# EasyEDA schematic SENSOR_SCH_FPC.json
TITLE: DRONE_SENSOR_SHIELD_FPC; REV: 2.0; Date: 17-11-2023; Sheet: 1/1; Drawn By: J.Rainey; Company: QUB
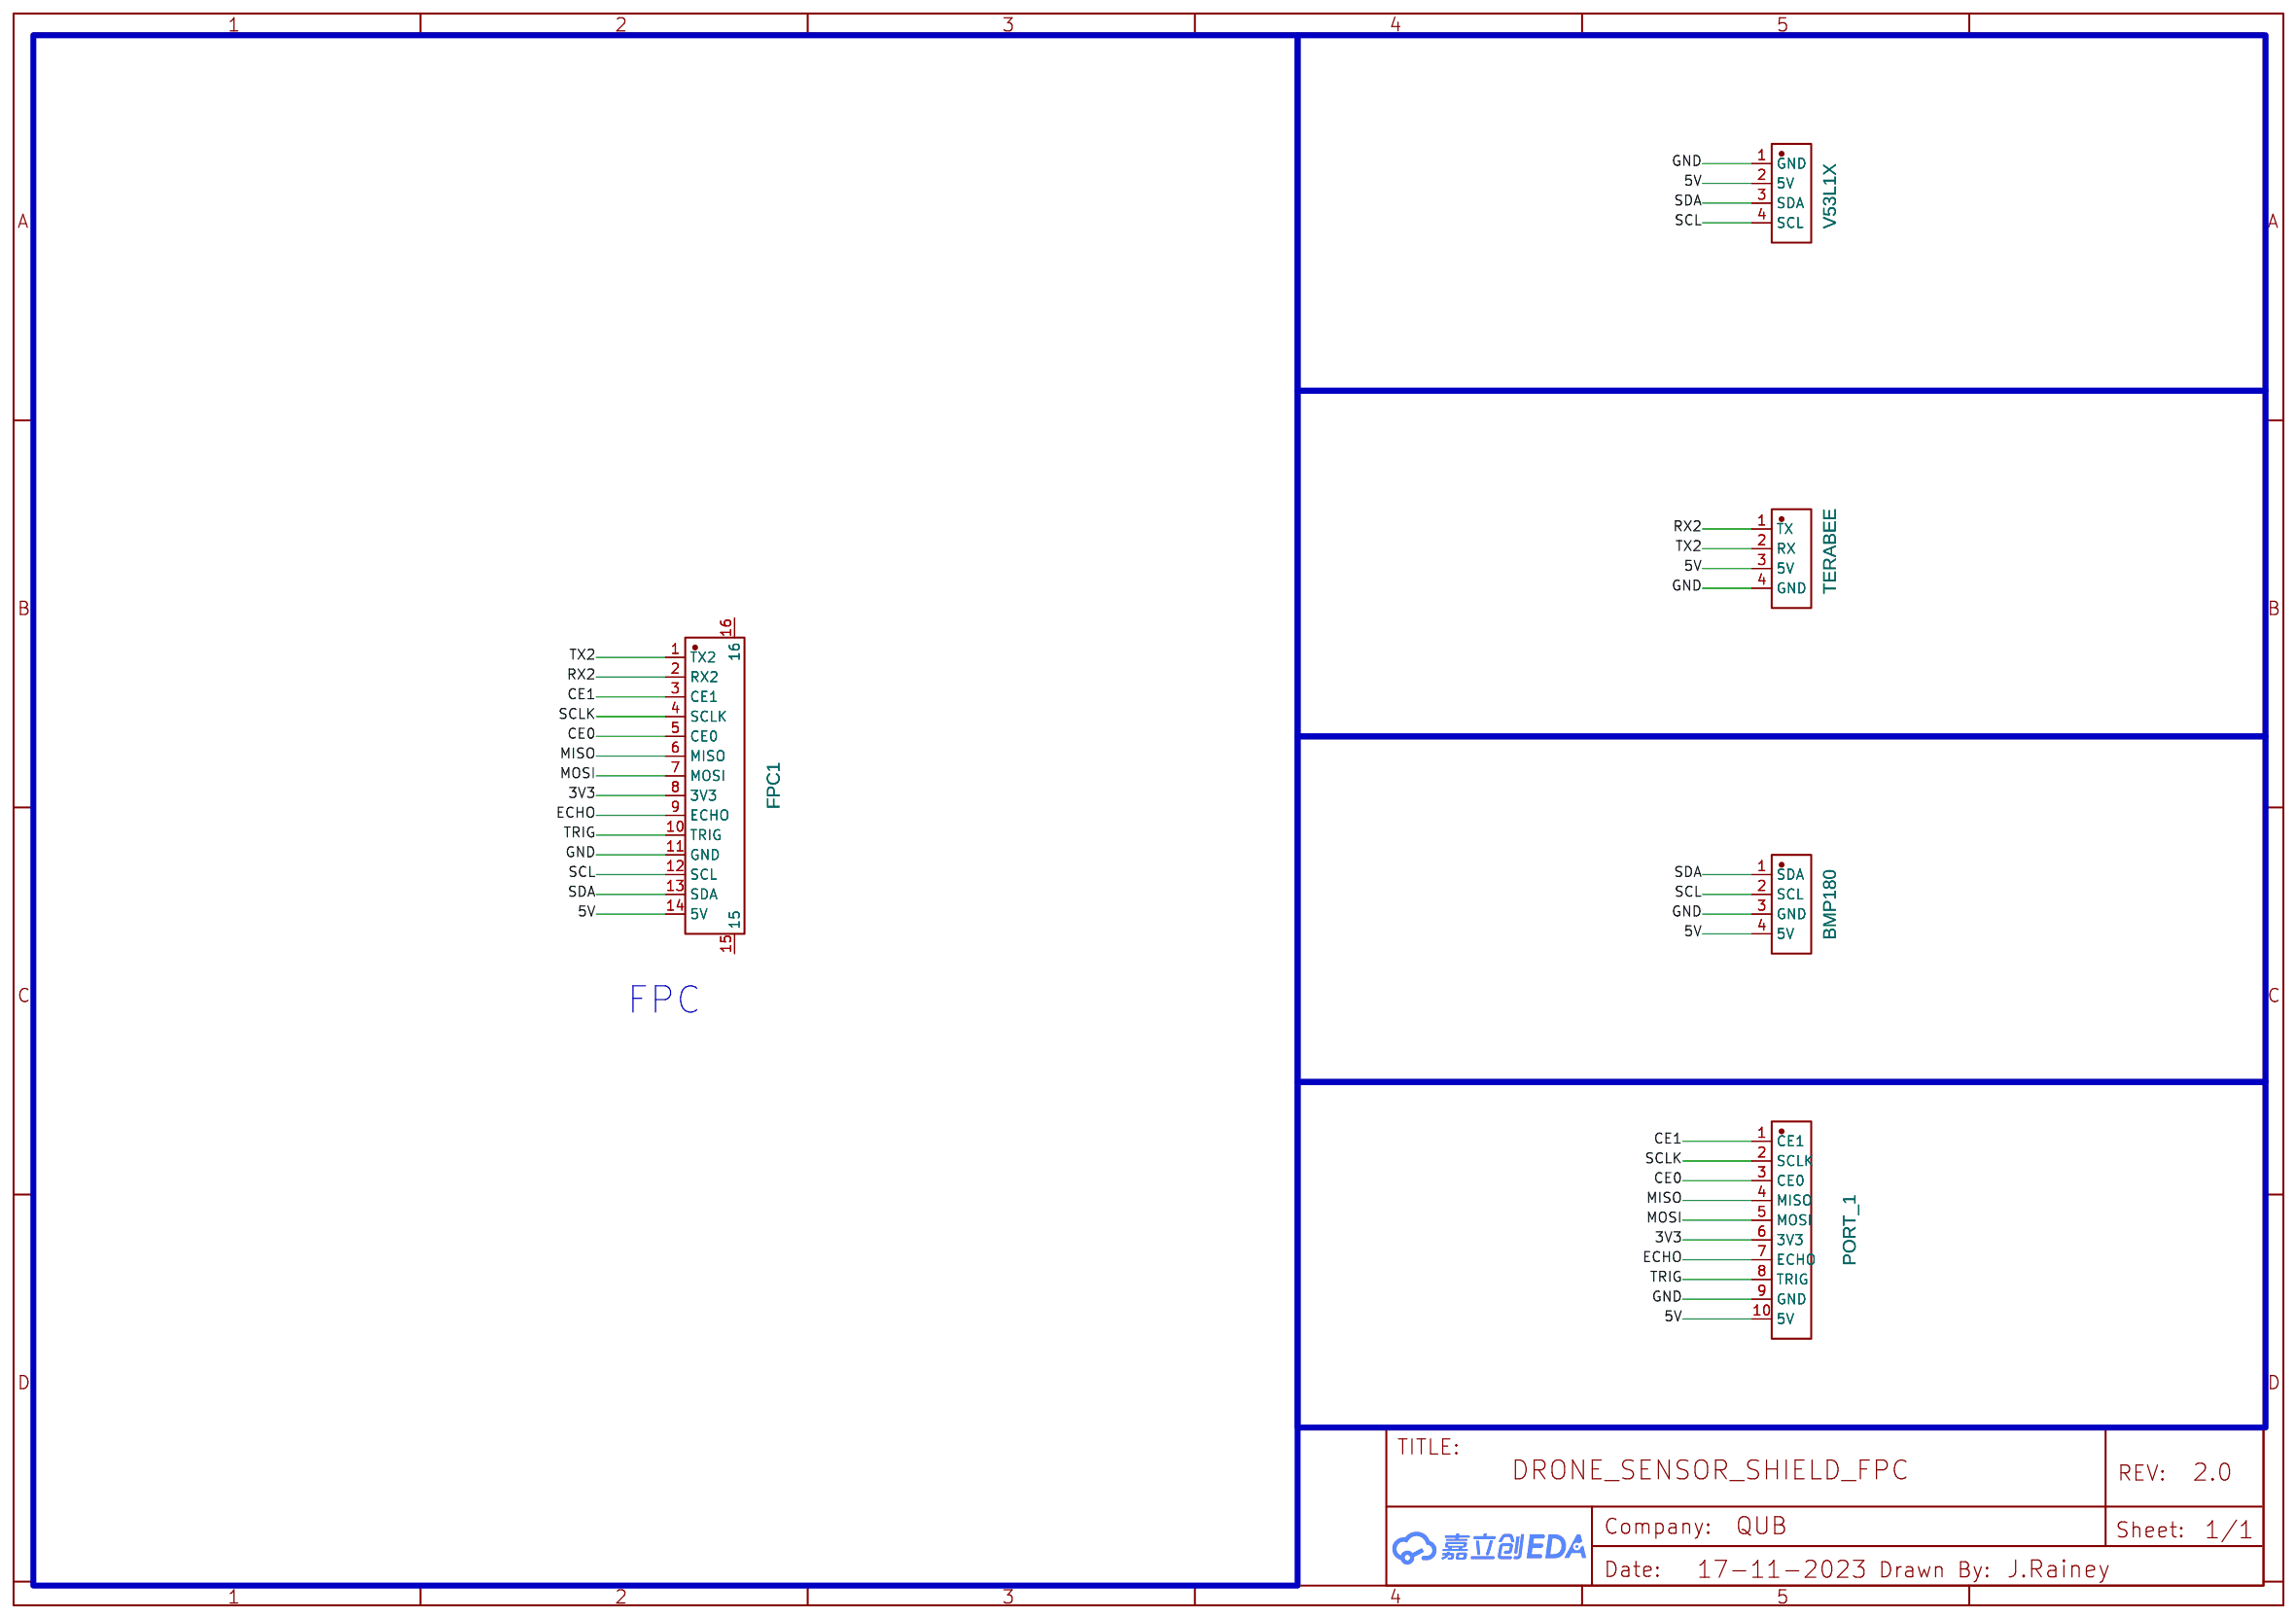
[diagram p0: schematic sheet]

## Parts
BMP180  PZ254V-11-04P  [HDR-TH_4P-P2.54-V-M]
FPC1  1.0K-FX-14PWB  [CONN-SMD_14P-P1.00_HDGC_1.0K-FX-14PWB]
PORT_1  PORT_1  [HDR-TH_10P-P2.54-V-F]
TERABEE  PZ254V-11-04P  [HDR-TH_4P-P2.54-V-M]
V53L1X  PZ254V-11-04P  [HDR-TH_4P-P2.54-V-M]

## Library data of the parts
BMP180 TERABEE V53L1X = PZ254V-11-04P: Supplier: LCSC; Supplier Part: C492403; Manufacturer: XFCN; Contributor: vatsal patel; JLCPCB Part Class: Extended Part
FPC1 = 1.0K-FX-14PWB: Contributor: LCSC; Supplier: LCSC; Supplier Part: C2914073; Manufacturer: HDGC(华德共创); JLCPCB Part Class: Extended Part
PORT_1 = CN10_2R54_10X1: Contributor: LCSC; Supplier: LCSC; Supplier Part: C9900001415; JLCPCB Part Class: Extended Part

## Nets
3V3: FPC1.8(3V3) PORT_1.6(3V3)
5V: BMP180.4(5V) FPC1.14(5V) PORT_1.10(5V) TERABEE.3(5V) V53L1X.2(5V)
GND: BMP180.3(GND) FPC1.11(GND) PORT_1.9(GND) TERABEE.4(GND) V53L1X.1(GND)
CE0: FPC1.5(CE0) PORT_1.3(CE0)
CE1: FPC1.3(CE1) PORT_1.1(CE1)
ECHO: FPC1.9(ECHO) PORT_1.7(ECHO)
MISO: FPC1.6(MISO) PORT_1.4(MISO)
MOSI: FPC1.7(MOSI) PORT_1.5(MOSI)
RX2: FPC1.2(RX2) TERABEE.1(TX)
SCL: BMP180.2(SCL) FPC1.12(SCL) V53L1X.4(SCL)
SCLK: FPC1.4(SCLK) PORT_1.2(SCLK)
SDA: BMP180.1(SDA) FPC1.13(SDA) V53L1X.3(SDA)
TRIG: FPC1.10(TRIG) PORT_1.8(TRIG)
TX2: FPC1.1(TX2) TERABEE.2(RX)

Not connected (* = marked no-connect by the designer): FPC1 15 16

## Notes on the sheet
- FPC
